# Altium schematic sheet Termination15V+Differential.SchDoc
size A4; CompanyName: Technische Hochschule Nürnberg Georg Simon Ohm; Address1: Fürther Straße 250; Address2: 90429 Nürnberg; Address3: GERMANY; SheetNumber: 16; SheetTotal: 21; CompanyName2: Institut ELSYS
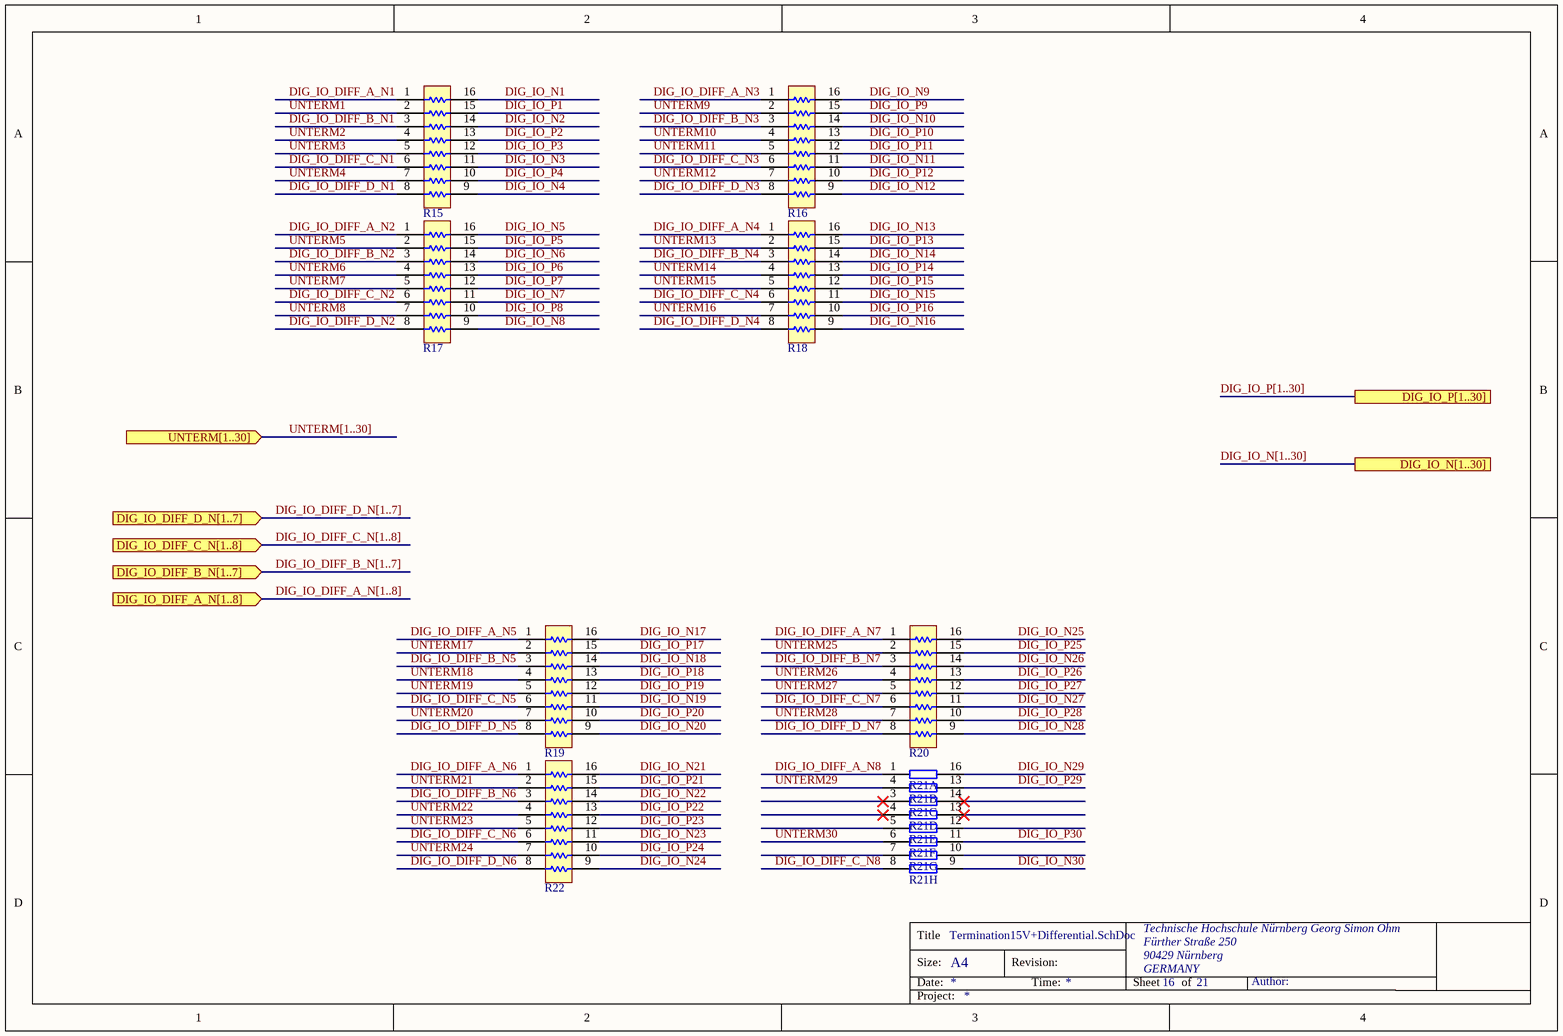
[diagram p0: Termination15V+Differential.SchDoc]

## Parts
R15  0.063W  [RESCAXE-50P380X160X45-16N]  (value not drawn)
R16  0.063W  [RESCAXE-50P380X160X45-16N]  (value not drawn)
R17  0.063W  [RESCAXE-50P380X160X45-16N]  (value not drawn)
R18  0.063W  [RESCAXE-50P380X160X45-16N]  (value not drawn)
R19  0.063W  [RESCAXE-50P380X160X45-16N]  (value not drawn)
R20  0.063W  [RESCAXE-50P380X160X45-16N]  (value not drawn)
R21  0.063W  [RESCAXE-50P380X160X45-16N]  (value not drawn)  (parts A,B,C,D,E,F,G,H of 8)
R22  0.063W  [RESCAXE-50P380X160X45-16N]  (value not drawn)

## Ports
DIG_IO_DIFF_A_N[1..8] (in), DIG_IO_DIFF_B_N[1..7] (in), DIG_IO_DIFF_C_N[1..8] (in), DIG_IO_DIFF_D_N[1..7] (in), DIG_IO_N[1..30], DIG_IO_P[1..30], UNTERM[1..30] (in)

## Nets
DIG_IO_DIFF_A_N1: R15.1
DIG_IO_DIFF_A_N2: R17.1
DIG_IO_DIFF_A_N3: R16.1
DIG_IO_DIFF_A_N4: R18.1
DIG_IO_DIFF_A_N5: R19.1
DIG_IO_DIFF_A_N6: R22.1
DIG_IO_DIFF_A_N7: R20.1
DIG_IO_DIFF_A_N8: R21.1
DIG_IO_DIFF_B_N1: R15.3
DIG_IO_DIFF_B_N2: R17.3
DIG_IO_DIFF_B_N3: R16.3
DIG_IO_DIFF_B_N4: R18.3
DIG_IO_DIFF_B_N5: R19.3
DIG_IO_DIFF_B_N6: R22.3
DIG_IO_DIFF_B_N7: R20.3
DIG_IO_DIFF_C_N1: R15.6
DIG_IO_DIFF_C_N2: R17.6
DIG_IO_DIFF_C_N3: R16.6
DIG_IO_DIFF_C_N4: R18.6
DIG_IO_DIFF_C_N5: R19.6
DIG_IO_DIFF_C_N6: R22.6
DIG_IO_DIFF_C_N7: R20.6
DIG_IO_DIFF_C_N8: R21.8
DIG_IO_DIFF_D_N1: R15.8
DIG_IO_DIFF_D_N2: R17.8
DIG_IO_DIFF_D_N3: R16.8
DIG_IO_DIFF_D_N4: R18.8
DIG_IO_DIFF_D_N5: R19.8
DIG_IO_DIFF_D_N6: R22.8
DIG_IO_DIFF_D_N7: R20.8
DIG_IO_N1: R15.16
DIG_IO_N2: R15.14
DIG_IO_N3: R15.11
DIG_IO_N4: R15.9
DIG_IO_N5: R17.16
DIG_IO_N6: R17.14
DIG_IO_N7: R17.11
DIG_IO_N8: R17.9
DIG_IO_N9: R16.16
DIG_IO_N10: R16.14
DIG_IO_N11: R16.11
DIG_IO_N12: R16.9
DIG_IO_N13: R18.16
DIG_IO_N14: R18.14
DIG_IO_N15: R18.11
DIG_IO_N16: R18.9
DIG_IO_N17: R19.16
DIG_IO_N18: R19.14
DIG_IO_N19: R19.11
DIG_IO_N20: R19.9
DIG_IO_N21: R22.16
DIG_IO_N22: R22.14
DIG_IO_N23: R22.11
DIG_IO_N24: R22.9
DIG_IO_N25: R20.16
DIG_IO_N26: R20.14
DIG_IO_N27: R20.11
DIG_IO_N28: R20.9
DIG_IO_N29: R21.16
DIG_IO_N30: R21.9
DIG_IO_P1: R15.15
DIG_IO_P2: R15.13
DIG_IO_P3: R15.12
DIG_IO_P4: R15.10
DIG_IO_P5: R17.15
DIG_IO_P6: R17.13
DIG_IO_P7: R17.12
DIG_IO_P8: R17.10
DIG_IO_P9: R16.15
DIG_IO_P10: R16.13
DIG_IO_P11: R16.12
DIG_IO_P12: R16.10
DIG_IO_P13: R18.15
DIG_IO_P14: R18.13
DIG_IO_P15: R18.12
DIG_IO_P16: R18.10
DIG_IO_P17: R19.15
DIG_IO_P18: R19.13
DIG_IO_P19: R19.12
DIG_IO_P20: R19.10
DIG_IO_P21: R22.15
DIG_IO_P22: R22.13
DIG_IO_P23: R22.12
DIG_IO_P24: R22.10
DIG_IO_P25: R20.15
DIG_IO_P26: R20.13
DIG_IO_P27: R20.12
DIG_IO_P28: R20.10
DIG_IO_P29: R21.13
DIG_IO_P30: R21.11
UNTERM1: R15.2
UNTERM2: R15.4
UNTERM3: R15.5
UNTERM4: R15.7
UNTERM5: R17.2
UNTERM6: R17.4
UNTERM7: R17.5
UNTERM8: R17.7
UNTERM9: R16.2
UNTERM10: R16.4
UNTERM11: R16.5
UNTERM12: R16.7
UNTERM13: R18.2
UNTERM14: R18.4
UNTERM15: R18.5
UNTERM16: R18.7
UNTERM17: R19.2
UNTERM18: R19.4
UNTERM19: R19.5
UNTERM20: R19.7
UNTERM21: R22.2
UNTERM22: R22.4
UNTERM23: R22.5
UNTERM24: R22.7
UNTERM25: R20.2
UNTERM26: R20.4
UNTERM27: R20.5
UNTERM28: R20.7
UNTERM29: R21.4
UNTERM30: R21.6

Not connected (* = marked no-connect by the designer): R21 3* 5 7 10 12 14*

## Buses and harness runs
bus DIG_IO_DIFF_A_N[1..8] = port DIG_IO_DIFF_A_N[1..8]
bus DIG_IO_DIFF_B_N[1..7] = port DIG_IO_DIFF_B_N[1..7]
bus DIG_IO_DIFF_C_N[1..8] = port DIG_IO_DIFF_C_N[1..8]
bus DIG_IO_DIFF_D_N[1..7] = port DIG_IO_DIFF_D_N[1..7]
bus DIG_IO_N[1..30] = port DIG_IO_N[1..30]
bus DIG_IO_P[1..30] = port DIG_IO_P[1..30]
bus UNTERM[1..30] = port UNTERM[1..30]

## Notes on the sheet
- Title
- Size:
- Date:
- A4
- Revision:
- Time:
- Sheet
- of
- Author:
- Project:

## Library data of the parts
R15-R20 R22 = 8xR-Array_1_part: Standard thick film resistor array with 8 resistors; Manufacturer1: Panasonic; MPN1: EXB2HV<2dig_res+#zeros><tol/jumper>V; Parameter1: V; Parameter1Desc: Package Method; Parameter2: J; Parameter2Desc: Tolerance Symbol; MaxVoltage: 100; Created: 2020-01-03_Thilo_Wendt; Supplier1: https://de.farnell.com/w/search?range=inc-in-stock&st=exb2hv; Package: RESCAXE-50P380X160X45-16N; HelpURL: https://www.mouser.de/datasheet/2/315/AOC0000C14-1108062.pdf; Parameter3: *; Parameter3Desc: *; ComponentLink1Description: Datasheet; ComponentLink1URL: https://www.mouser.de/datasheet/2/315/AOC0000C14-1108062.pdf; ComponentLink2Description: Landpattern; ComponentLink2URL: https://industrial.panasonic.com/cdbs/www-data/pdf/AOC0000/AOC0000COL4.pdf
R21 = 8xR-Array: Standard thick film resistor array with 8 resistors; Manufacturer1: Panasonic; MPN1: EXB2HV<2dig_res+#zeros><tol/jumper>V; Parameter1: V; Parameter1Desc: Package Method; Parameter2: J; Parameter2Desc: Tolerance Symbol; MaxVoltage: 100; Created: 2020-01-03_Thilo_Wendt; Supplier1: https://de.farnell.com/w/search?range=inc-in-stock&st=exb2hv; Package: RESCAXE-50P380X160X45-16N; HelpURL: https://www.mouser.de/datasheet/2/315/AOC0000C14-1108062.pdf; Parameter3: *; Parameter3Desc: *; ComponentLink1Description: Datasheet; ComponentLink1URL: https://www.mouser.de/datasheet/2/315/AOC0000C14-1108062.pdf; ComponentLink2Description: Landpattern; ComponentLink2URL: https://industrial.panasonic.com/cdbs/www-data/pdf/AOC0000/AOC0000COL4.pdf